# Altium schematic sheet LVC2000A.2-2S.SchDoc
size A3; SheetNumber: 0; SheetTotal: 0
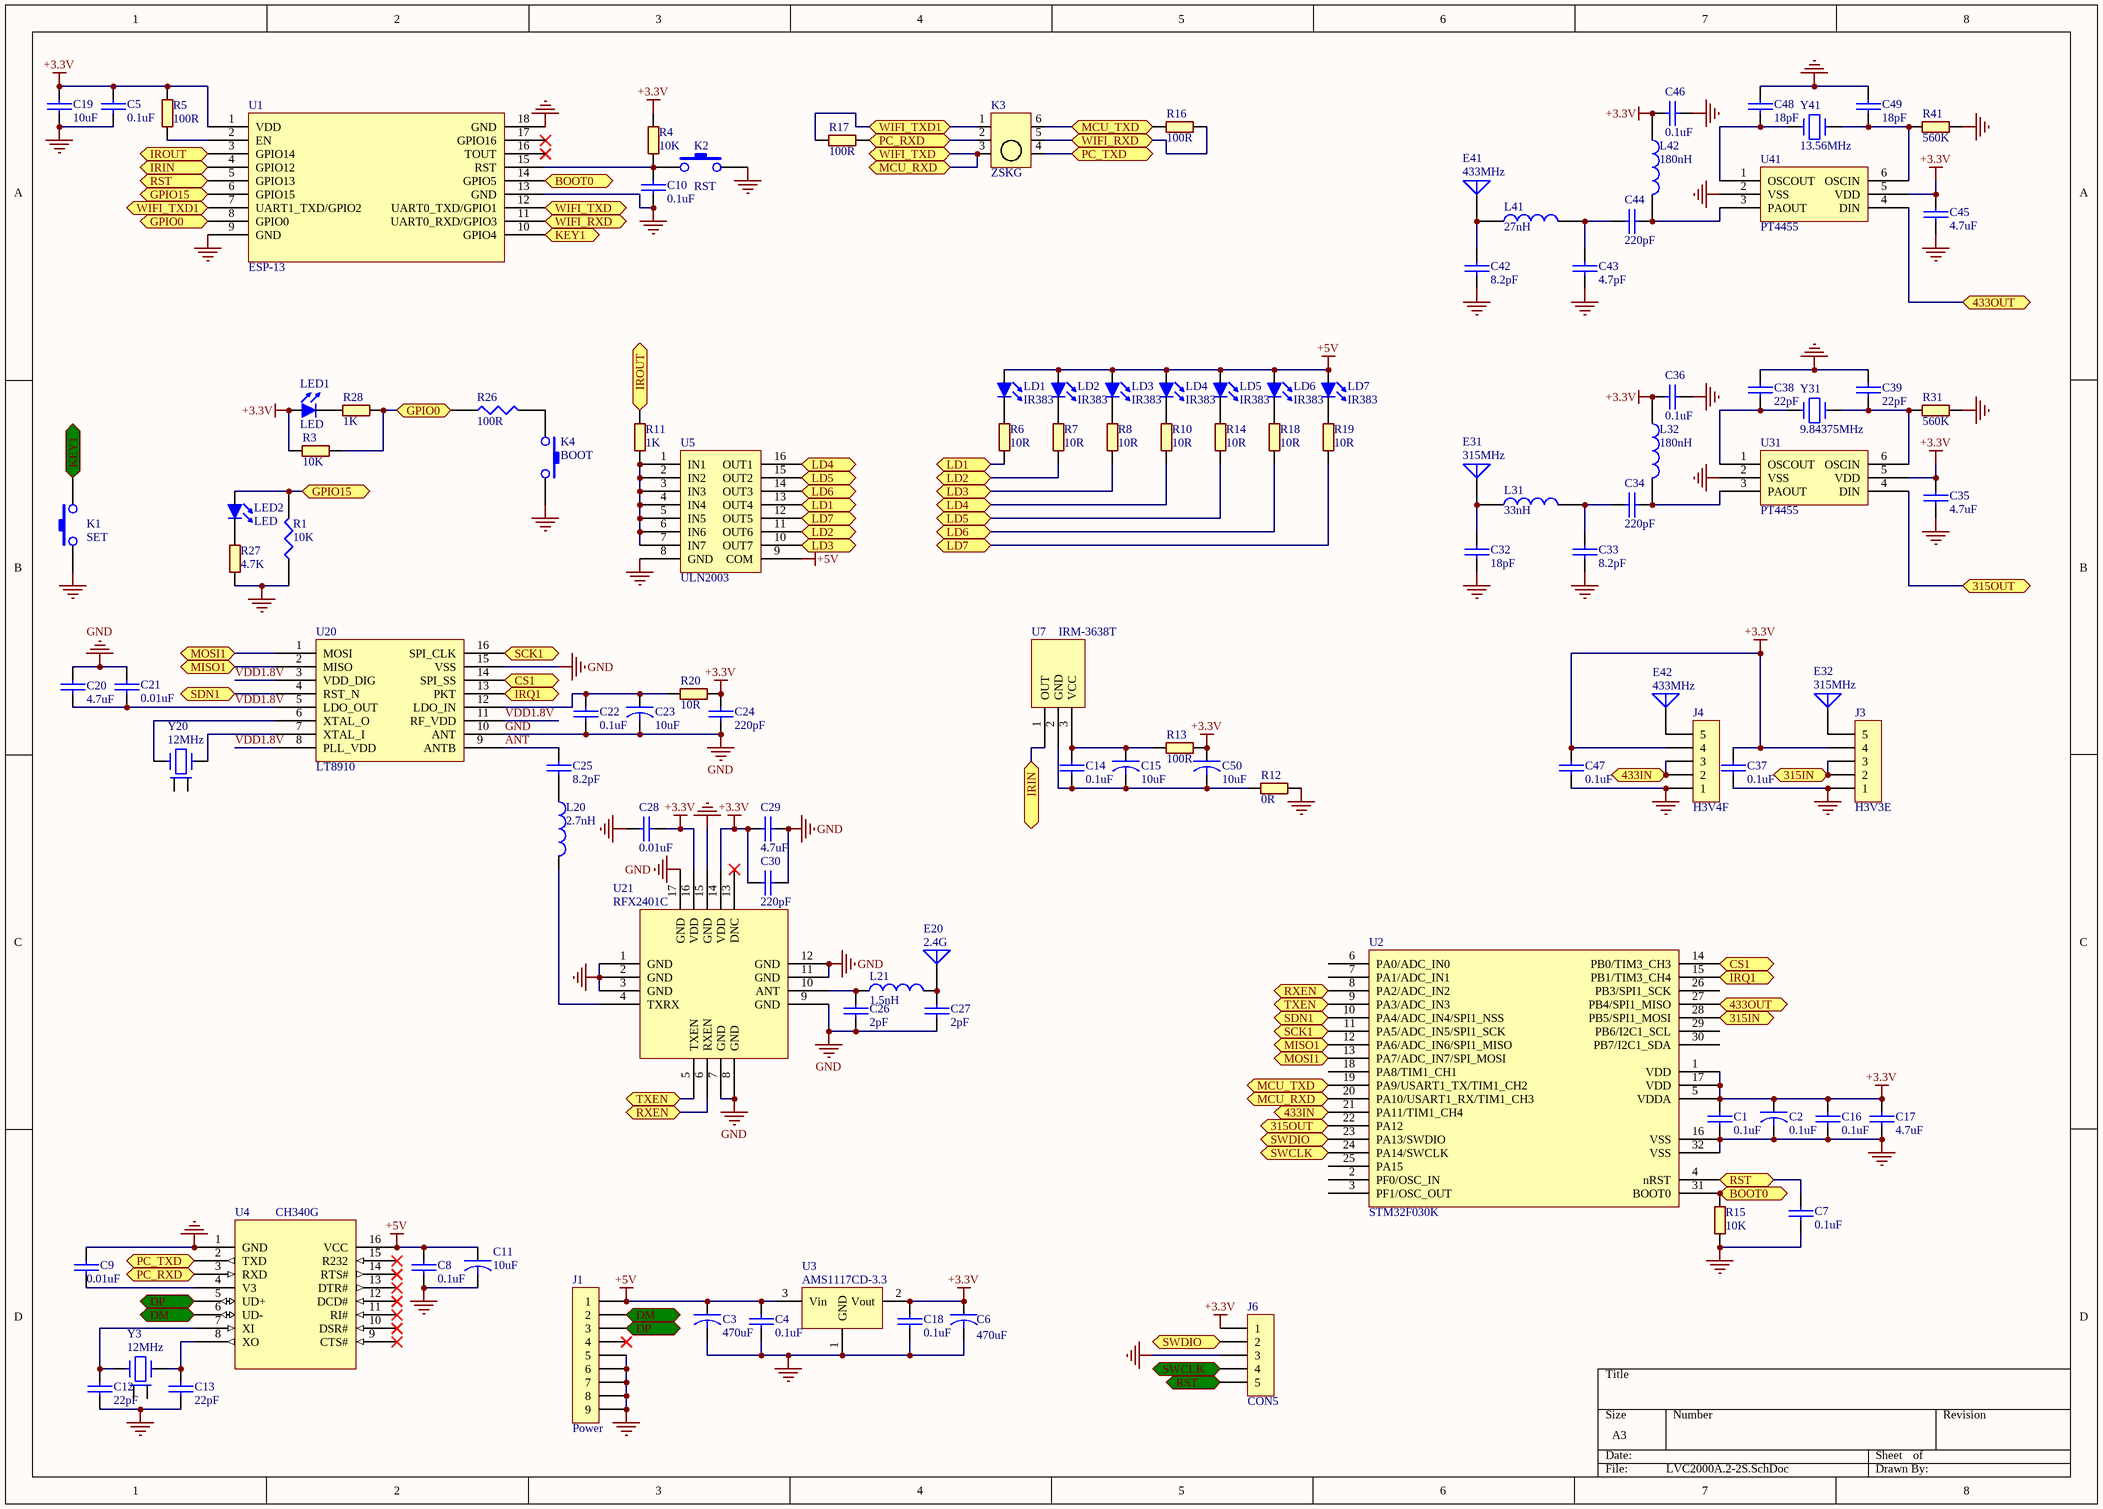
[diagram p0: LVC2000A.2-2S.SchDoc]

## Parts
C1  0.1uF  [C0603]
C2  0.1uF  [C0603]
C3  470uF  [C9090]
C4  0.1uF  [C0603]
C5  0.1uF  [C0603]
C6  470uF  [C9090]
C7  0.1uF  [C0603]
C8  0.1uF  [C0603]
C9  0.01uF  [C0603]
C10  0.1uF  [C0603]
C11  10uF  [C0805]
C12  22pF  [C0603]
C13  22pF  [C0603]
C14  0.1uF  [C0603]
C15  10uF  [C0805]
C16  0.1uF  [C0603]
C17  4.7uF  [C0603]
C18  0.1uF  [C0603]
C19  10uF  [C0805]
C20  4.7uF  [C0603]
C21  0.01uF  [C0603]
C22  0.1uF  [C0603]
C23  10uF  [C0805]
C24  220pF  [C0603]
C25  8.2pF  [C0603]
C26  2pF  [C0603]
C27  2pF  [C0603]
C28  0.01uF  [C0603]
C29  4.7uF  [C0603]
C30  220pF  [C0603]
C32  18pF  [C0603]
C33  8.2pF  [C0603]
C34  220pF  [C0603]
C35  4.7uF  [C0603]
C36  0.1uF  [C0603]
C37  0.1uF  [C0603]
C38  22pF  [C0603]
C39  22pF  [C0603]
C42  8.2pF  [C0603]
C43  4.7pF  [C0603]
C44  220pF  [C0603]
C45  4.7uF  [C0603]
C46  0.1uF  [C0603]
C47  0.1uF  [C0603]
C48  18pF  [C0603]
C49  18pF  [C0603]
C50  10uF  [C0805]
E20  2.4G  [ANT-24G]
E31  315MHz  [ANT-315]
E32  315MHz  [ANT-315-PCB1]
E41  433MHz  [ANT-433]
E42  433MHz  [ANT-433-PCB2]
J1  Power  [USB-MICRO4]
J3  H3V3E  [H3V4F]
J4  H3V4F  [H3V4F]
J6  CON5  [CH2.0-5Y]
K1  SET  [BUTTON3]
K2  RST  [BUTTON4]
K3  ZSKG  [SW-ZS-8.5]
K4  BOOT  [BUTTON4]
L20  2.7nH  [L0603]
L21  1.5nH  [L0603]
L31  33nH  [L0603]
L32  180nH  [L0603]
L41  27nH  [L0603]
L42  180nH  [L0603]
LD1  IR383  [LED5MM-W-12MM]
LD2  IR383  [LED5MM-W-12MM]
LD3  IR383  [LED5MM-W-12MM]
LD4  IR383  [LED5MM-W-12MM]
LD5  IR383  [LED5MM-W-12MM]
LD6  IR383  [LED5MM-W-12MM]
LD7  IR383  [LED5MM-W-12MM]
LED1  LED  [LED0805]
LED2  LED  [LED0805]
R1  10K  [R0603]
R3  10K  [R0603]
R4  10K  [R0603]
R5  100R  [R0603]
R6  10R  [R0805]
R7  10R  [R0805]
R8  10R  [R0805]
R10  10R  [R0805]
R11  1K  [R0603]
R12  0R  [R0603]
R13  100R  [R0603]
R14  10R  [R0805]
R15  10K  [R0603]
R16  100R  [R0603]
R17  100R  [R0603]
R18  10R  [R0805]
R19  10R  [R0805]
R20  10R  [R0603]
R26  100R  [R0603]
R27  4.7K  [R0603]
R28  1K  [R0603]
R31  560K  [R0603]
R41  560K  [R0603]
U1  ESP-13  [ESP-13]
U2  STM32F030K  [LQFP-32]
U3  AMS1117CD-3.3  [TO-252]
U4  CH340G  [SOP-16]
U5  ULN2003  [SOP-16]
U7  IRM-3638T  [IR1838]
U20  LT8910  [SSOP-16]
U21  RFX2401C  [QFN-16]
U31  PT4455  [SOT-23-6]
U41  PT4455  [SOT-23-6]
Y3  12MHz  [JT3225A]
Y20  12MHz  [JT3225A]
Y31  9.84375MHz  [JT49SMD]
Y41  13.56MHz  [JT3225WY]

## Ports
315IN, 315OUT, 433IN, 433OUT, BOOT0 (bidir), CS1 (bidir), DM, DP, GPIO0, GPIO15, IRIN (bidir), IROUT, IROUT (bidir), IRQ1 (bidir), KEY1, LD1 (bidir), LD2, LD3 (bidir), LD4 (bidir), LD5 (bidir), LD6 (bidir), LD7 (bidir), MCU_RXD, MCU_TXD, MISO1, MISO1 (bidir), MOSI1, MOSI1 (bidir), PC_RXD, PC_TXD, RST, RST (bidir), RXEN (bidir), SCK1, SCK1 (bidir), SDN1 (bidir), SWCLK, SWDIO, SWDIO (bidir), TXEN (bidir), WIFI_RXD, WIFI_TXD, WIFI_TXD1

## Nets
+3.3V: C1.1 C2.1 C5.1 C6.1 C16.1 C17.1 C18.1 C19.2 C24.1 C28.1 C29.2 C30.2 C35.1 C36.1 C37.1 C45.1 C46.1 C47.1 C50.1 J3.4 J4.4 J6.1 L32.1 L42.1 LED1.1 R3.1 R4.1 R5.1 R13.1 R20.2 U1.1(VDD) U2.1(VDD) U2.5(VDDA) U2.17(VDD) U3.2(Vout) U21.14(VDD) U21.16(VDD) U31.5(VDD) U41.5(VDD)
+5V: C3.1 C4.1 C8.1 C11.1 J1.1 LD1.1 LD2.1 LD3.1 LD4.1 LD5.1 LD6.1 LD7.1 U3.3(Vin) U4.16(VCC) U5.9(COM)
GND: C1.2 C2.2 C3.2 C4.2 C5.2 C6.2 C7.2 C8.2 C9.2 C10.2 C11.2 C12.2 C13.2 C16.2 C17.2 C18.2 C19.1 C20.1 C21.1 C22.2 C23.2 C24.2 C26.1 C27.2 C28.2 C29.1 C30.1 C32.2 C33.2 C35.2 C36.2 C37.2 C38.1 C39.1 C42.2 C43.2 C45.2 C46.2 C47.2 C48.1 C49.1 J1.5 J1.6 J1.7 J1.8 J1.9 J3.1 J4.1 J6.3 K1.1 K2.2 K4.2 R1.1 R12.1 R15.2 R27.2 R31.2 R41.1 U1.9(GND) U1.13(GND) U1.18(GND) U2.16(VSS) U2.32(VSS) U3.1(GND) U4.1(GND) U5.8(GND) U20.10(ANT) U20.15(VSS) U21.1(GND) U21.2(GND) U21.3(GND) U21.7(GND) U21.8(GND) U21.9(GND) U21.11(GND) U21.12(GND) U21.15(GND) U21.17(GND) U31.2(VSS) U41.2(VSS)
315IN: J3.2 J3.3 U2.28(PB5/SPI1_MOSI) ; port 315IN
315OUT: U2.22(PA12) U31.4(DIN) ; port 315OUT
433IN: J4.2 J4.3 U2.21(PA11/TIM1_CH4) ; port 433IN
433OUT: U2.27(PB4/SPI1_MISO) U41.4(DIN) ; port 433OUT
ANT: C25.1 U20.9(ANTB)
BOOT0: R15.1 U1.14(GPIO5) U2.31(BOOT0) ; port BOOT0
CS1: U2.14(PB0/TIM3_CH3) U20.14(SPI_SS) ; port CS1
DM: J1.2 U4.6(UD-) ; port DM
DP: J1.3 U4.5(UD+) ; port DP
GPIO0: R3.2 R26.1 R28.1 U1.8(GPIO0) ; port GPIO0
GPIO15: LED2.1 R1.2 U1.6(GPIO15) ; port GPIO15
IRIN: U1.4(GPIO12) U7.1(OUT) ; port IRIN
IROUT: R11.2 U1.3(GPIO14) ; port IROUT
IRQ1: U2.15(PB1/TIM3_CH4) U20.13(PKT) ; port IRQ1
KEY1: K1.2 U1.10(GPIO4) ; port KEY1
LD1: R6.1 U5.13(OUT4) ; port LD1
LD2: R7.1 U5.11(OUT6) ; port LD2
LD3: R8.1 U5.10(OUT7) ; port LD3
LD4: R10.1 U5.16(OUT1) ; port LD4
LD5: R14.1 U5.15(OUT2) ; port LD5
LD6: R18.1 U5.14(OUT3) ; port LD6
LD7: R19.1 U5.12(OUT5) ; port LD7
MCU_RXD: K3.3 U1.12(UART0_TXD/GPIO1) U2.20(PA10/USART1_RX/TIM1_CH3) ; port WIFI_TXD, port MCU_RXD
MCU_TXD: K3.6 R16.1 U2.19(PA9/USART1_TX/TIM1_CH2) ; port MCU_TXD
MISO1: U2.12(PA6/ADC_IN6/SPI1_MISO) U20.2(MISO) ; port MISO1
MOSI1: U2.13(PA7/ADC_IN7/SPI_MOSI) U20.1(MOSI) ; port MOSI1
PC_RXD: K3.2 R17.2 U4.3(RXD) ; port PC_RXD
PC_TXD: K3.4 U4.2(TXD) ; port PC_TXD
RST: C7.1 J6.5 U1.5(GPIO13) U2.4(nRST) ; port RST
RXEN: U2.8(PA2/ADC_IN2) U21.6(RXEN) ; port RXEN
SCK1: U2.11(PA5/ADC_IN5/SPI1_SCK) U20.16(SPI_CLK) ; port SCK1
SDN1: U2.10(PA4/ADC_IN4/SPI1_NSS) U20.4(RST_N) ; port SDN1
SWCLK: J6.4 U2.24(PA14/SWCLK) ; port SWCLK
SWDIO: J6.2 U2.23(PA13/SWDIO) ; port SWDIO
TXEN: U2.9(PA3/ADC_IN3) U21.5(TXEN) ; port TXEN
VDD1.8V: C20.2 C21.2 U20.3(VDD_DIG) U20.5(LDO_OUT) U20.8(PLL_VDD) U20.11(RF_VDD)
WIFI_RXD: K3.5 R16.2 U1.11(UART0_RXD/GPIO3) ; port WIFI_RXD
WIFI_TXD1: K3.1 R17.1 U1.7(UART1_TXD/GPIO2) ; port WIFI_TXD1
NetC9_1: C9.1 U4.4(V3)
NetC10_1: C10.1 K2.1 R4.2 U1.15(RST)
NetC12_1: C12.1 U4.7(XI) Y3.1
NetC13_1: C13.1 U4.8(XO) Y3.3
NetC14_1: C14.1 C15.1 R13.2 U7.3(VCC)
NetC14_2: C14.2 C15.2 C50.2 R12.2 U7.2(GND)
NetC22_1: C22.1 C23.1 R20.1 U20.12(LDO_IN)
NetC25_2: C25.2 L20.1
NetC26_2: C26.2 L21.1 U21.10(ANT)
NetC27_1: C27.1 E20.1(A) L21.2
NetC32_1: C32.1 E31.1(A) L31.1
NetC33_1: C33.1 C34.2 L31.2
NetC34_1: C34.1 L32.2 U31.3(PAOUT)
NetC38_2: C38.2 U31.1(OSCOUT) Y31.1
NetC39_2: C39.2 R31.1 U31.6(OSCIN) Y31.2
NetC42_1: C42.1 E41.1(A) L41.1
NetC43_1: C43.1 C44.2 L41.2
NetC44_1: C44.1 L42.2 U41.3(PAOUT)
NetC48_2: C48.2 U41.1(OSCOUT) Y41.1
NetC49_2: C49.2 R41.2 U41.6(OSCIN) Y41.2
NetE32_1: E32.1(A) J3.5
NetE42_1: E42.1(A) J4.5
NetK4_1: K4.1 R26.2
NetL20_2: L20.2 U21.4(TXRX)
NetLD1_2: LD1.2 R6.2
NetLD2_2: LD2.2 R7.2
NetLD3_2: LD3.2 R8.2
NetLD4_2: LD4.2 R10.2
NetLD5_2: LD5.2 R14.2
NetLD6_2: LD6.2 R18.2
NetLD7_2: LD7.2 R19.2
NetLED1_2: LED1.2 R28.2
NetLED2_2: LED2.2 R27.1
NetR5_2: R5.2 U1.2(EN)
NetR11_1: R11.1 U5.1(IN1) U5.2(IN2) U5.3(IN3) U5.4(IN4) U5.5(IN5) U5.6(IN6) U5.7(IN7)
NetU20_6: U20.6(XTAL_O) Y20.3
NetU20_7: U20.7(XTAL_I) Y20.1

Not connected (* = marked no-connect by the designer): J1 4*; U1 16(TOUT)* 17(GPIO16)*; U2 2(PF0/OSC_IN) 3(PF1/OSC_OUT) 6(PA0/ADC_IN0) 7(PA1/ADC_IN1) 18(PA8/TIM1_CH1) 25(PA15) 26(PB3/SPI1_SCK) 29(PB6/I2C1_SCL) 30(PB7/I2C1_SDA); U4 9(CTS#)* 10(DSR#)* 11(RI#)* 12(DCD#)* 13(DTR#)* 14(RTS#)* 15(R232)*; U21 13(DNC)*; Y3 2 4; Y20 2 4

## Library data of the parts
C1 C4 C5 C7-C10 C12-C14 C16-C22 C24-C30 C32-C39 C42-C49 = CAP: Capacitor
C2 C3 C6 C11 C15 C23 C50 = CAPACITOR
E20 E31 E32 E41 E42 = ANTENNA: Generic Antenna
J1 = CON9: Connector
J3 J4 J6 = CON5: Connector
K1 K2 K4 = SW-PB
L20 L21 = Inductor
L31 L32 L41 L42 = INDUCTOR
LD1-LD7 = LED
R1 R26 = RES1
R3-R8 R10-R20 R27 R28 = R
R31 R41 = R: RES
U3 = AMS1117
U4 = CH340G: USB to TTL Serial / UART
U7 = IR1838
U20 = LT8900
U31 U41 = PT4450
Y3 Y20 = CRYSTAL2
Y31 Y41 = CRYSTAL